# EAGLE design ESPHome 4ch CCT LED driver (EAGLE 9.2.2)
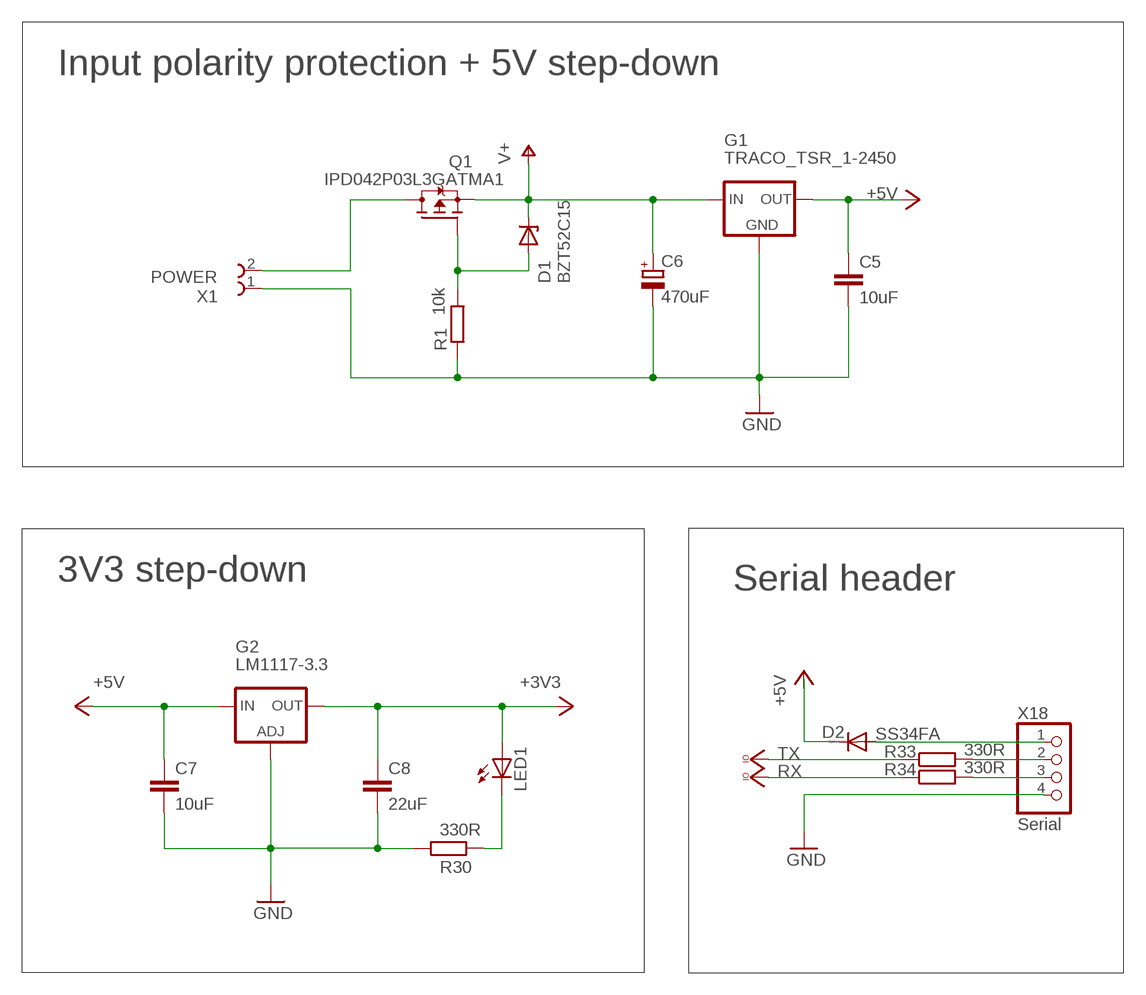
[diagram p0: schematic, sheet 1, part 1 of 2]
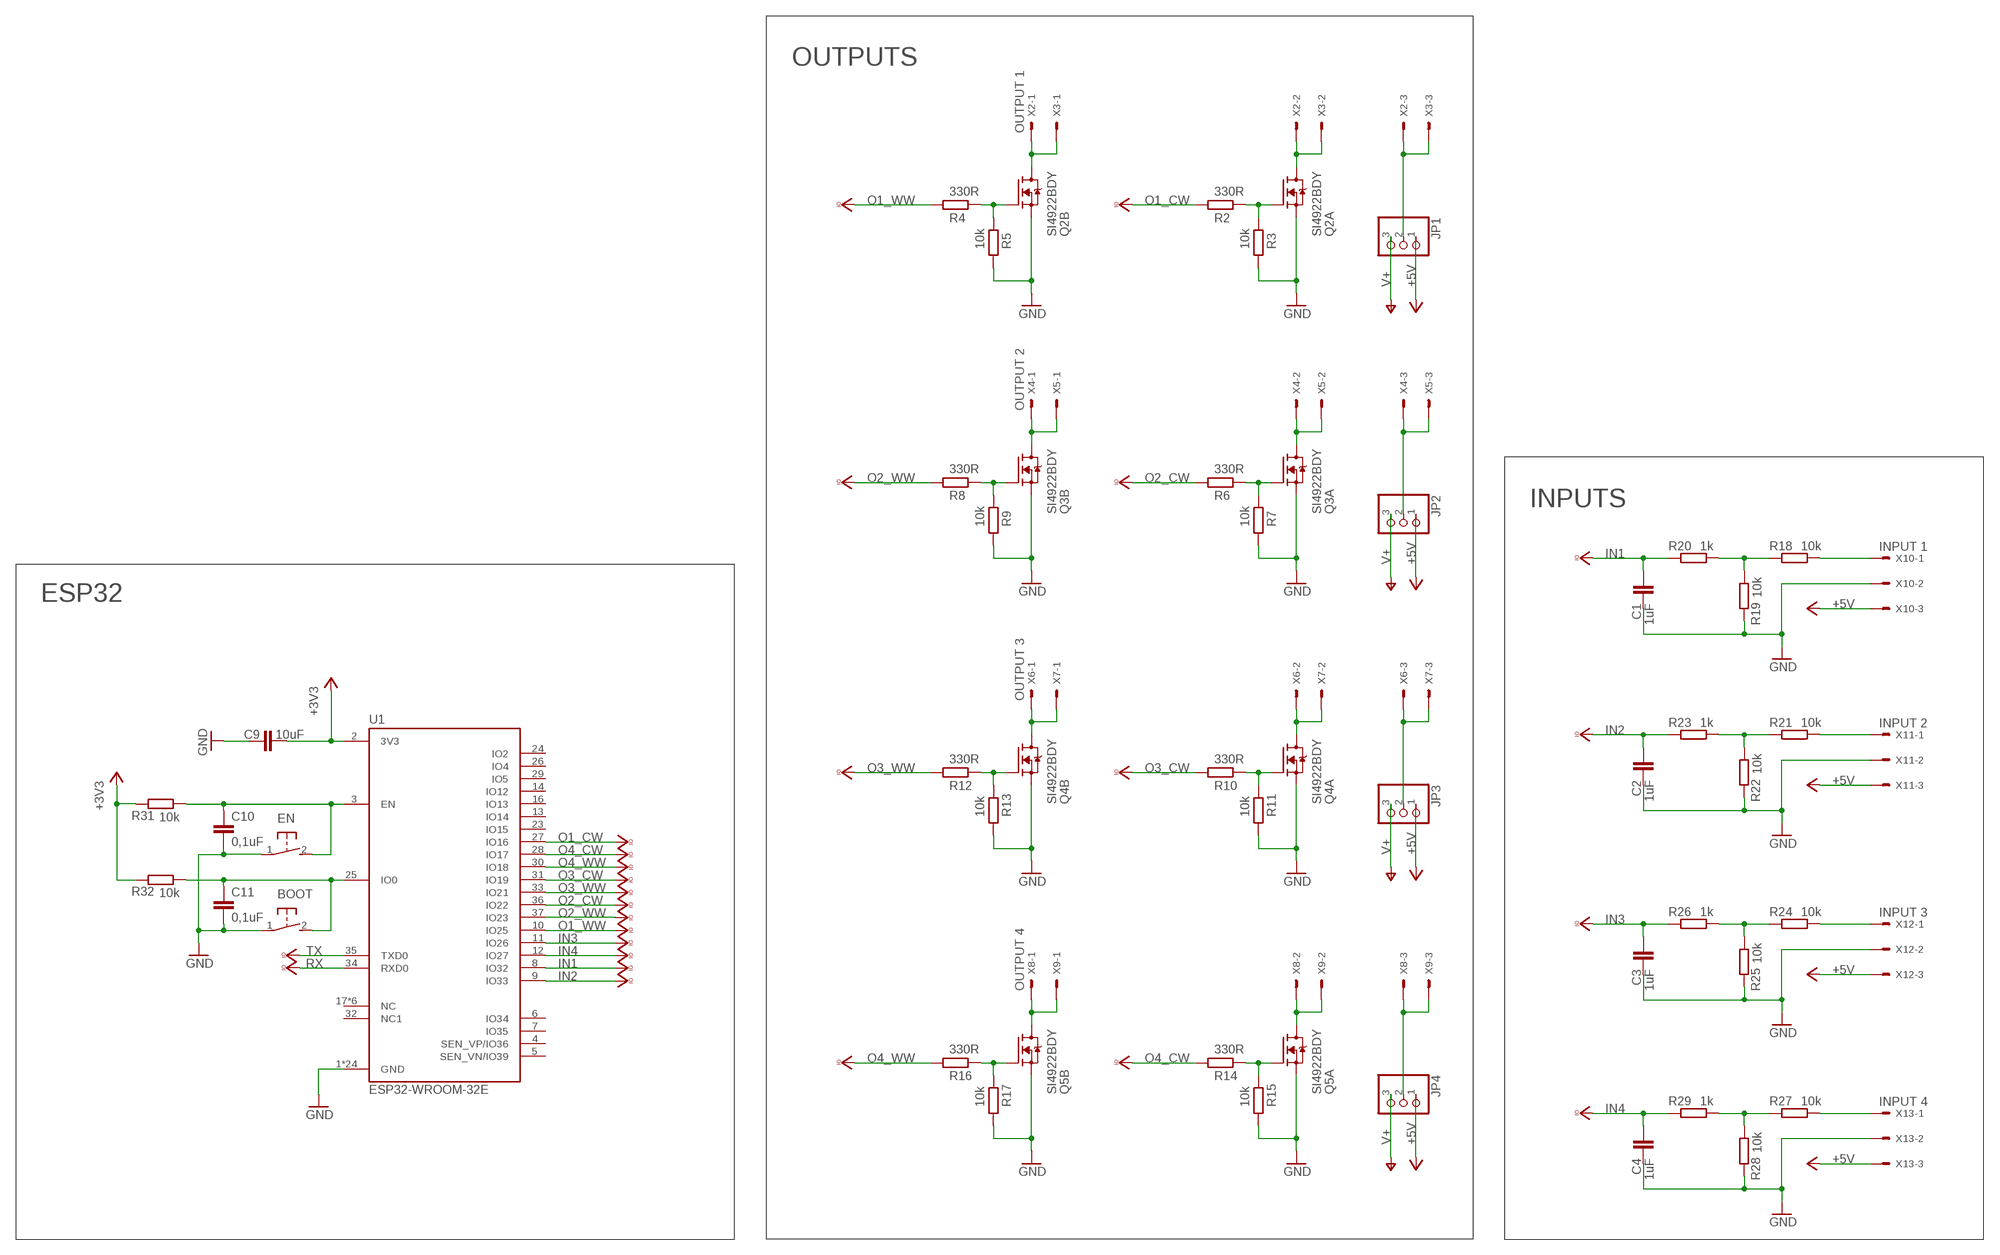
[diagram p1: schematic, sheet 1, part 2 of 2]

## Parts
BOOT  DTSM-3  [DTSM-3]
C1  1uF  C-EUC1206  [C1206]
C2  1uF  C-EUC1206  [C1206]
C3  1uF  C-EUC1206  [C1206]
C4  1uF  C-EUC1206  [C1206]
C5  10uF  C-EUC1206  [C1206]
C6  470uF  CPOL-EUE5-10.5  [E5-10,5]
C7  10uF  C-EUC1206  [C1206]
C8  22uF  C-EUC1206  [C1206]
C9  10uF  C-EUC1206  [C1206]
C10  0,1uF  C-EUC0603  [C0603]
C11  0,1uF  C-EUC0603  [C0603]
D1  BZT52C15  BZT52  [SOD123]
D2  SS34FA  DIODE-SOD123  [SOD123]
EN  DTSM-3  [DTSM-3]
G1  TRACO_TSR_1-2450  [TRACO_TSR_1-24XX]
G2  LM1117-3.3  LM1117  [SOT223]
JP1  PINHD-1X3  [1X03]
JP2  PINHD-1X3  [1X03]
JP3  PINHD-1X3  [1X03]
JP4  PINHD-1X3  [1X03]
LED1  LEDCHIPLED_1206  [CHIPLED_1206]
Q1  IPD042P03L3GATMA1  [TO252]
Q2  SI4922BDY  [SO-8]
Q3  SI4922BDY  [SO-8]
Q4  SI4922BDY  [SO-8]
Q5  SI4922BDY  [SO-8]
R1  10k  R-EU_R0805  [R0805]
R2  330R  R-EU_R0805  [R0805]
R3  10k  R-EU_R0805  [R0805]
R4  330R  R-EU_R0805  [R0805]
R5  10k  R-EU_R0805  [R0805]
R6  330R  R-EU_R0805  [R0805]
R7  10k  R-EU_R0805  [R0805]
R8  330R  R-EU_R0805  [R0805]
R9  10k  R-EU_R0805  [R0805]
R10  330R  R-EU_R0805  [R0805]
R11  10k  R-EU_R0805  [R0805]
R12  330R  R-EU_R0805  [R0805]
R13  10k  R-EU_R0805  [R0805]
R14  330R  R-EU_R0805  [R0805]
R15  10k  R-EU_R0805  [R0805]
R16  330R  R-EU_R0805  [R0805]
R17  10k  R-EU_R0805  [R0805]
R18  10k  R-EU_R0805  [R0805]
R19  10k  R-EU_R0805  [R0805]
R20  1k  R-EU_R0805  [R0805]
R21  10k  R-EU_R0805  [R0805]
R22  10k  R-EU_R0805  [R0805]
R23  1k  R-EU_R0805  [R0805]
R24  10k  R-EU_R0805  [R0805]
R25  10k  R-EU_R0805  [R0805]
R26  1k  R-EU_R0805  [R0805]
R27  10k  R-EU_R0805  [R0805]
R28  10k  R-EU_R0805  [R0805]
R29  1k  R-EU_R0805  [R0805]
R30  330R  R-EU_R0805  [R0805]
R31  10k  R-EU_R0805  [R0805]
R32  10k  R-EU_R0805  [R0805]
R33  330R  R-EU_R0805  [R0805]
R34  330R  R-EU_R0805  [R0805]
U1  ESP32-WROOM-32E  ESP32-WROOM-32E_(16MB)  [XCVR_ESP32-WROOM-32E_(16MB)]
X1  POWER  2PIN_5MM_TERMINAL  [2PIN_5MM_TERMMINAL]
X2  OUTPUT 1  JST-XH-03-PIN-LONG-PAD  [JST-XH-03-PACKAGE-LONG-PAD]
X3  JST-XH-03  JST-XH-03-PIN-LONG-PAD  [JST-XH-03-PACKAGE-LONG-PAD]
X4  OUTPUT 2  JST-XH-03-PIN-LONG-PAD  [JST-XH-03-PACKAGE-LONG-PAD]
X5  JST-XH-03  JST-XH-03-PIN-LONG-PAD  [JST-XH-03-PACKAGE-LONG-PAD]
X6  OUTPUT 3  JST-XH-03-PIN-LONG-PAD  [JST-XH-03-PACKAGE-LONG-PAD]
X7  JST-XH-03  JST-XH-03-PIN-LONG-PAD  [JST-XH-03-PACKAGE-LONG-PAD]
X8  OUTPUT 4  JST-XH-03-PIN-LONG-PAD  [JST-XH-03-PACKAGE-LONG-PAD]
X9  JST-XH-03  JST-XH-03-PIN-LONG-PAD  [JST-XH-03-PACKAGE-LONG-PAD]
X10  INPUT 1  JST-XH-03-PIN-LONG-PAD  [JST-XH-03-PACKAGE-LONG-PAD]
X11  INPUT 2  JST-XH-03-PIN-LONG-PAD  [JST-XH-03-PACKAGE-LONG-PAD]
X12  INPUT 3  JST-XH-03-PIN-LONG-PAD  [JST-XH-03-PACKAGE-LONG-PAD]
X13  INPUT 4  JST-XH-03-PIN-LONG-PAD  [JST-XH-03-PACKAGE-LONG-PAD]
X18  Serial  PINHD-1X4  [1X04]

## Nets
+3V3: C8.1 C9.1 G2.2(OUT) G2.4(OUT) LED1.A R31.1 R32.1 U1.2(3V3)
+5V: C5.1 C7.1 D2.C G1.VOUT(OUT) G2.3(IN) JP1.1 JP2.1 JP3.1 JP4.1 X10.3 X11.3 X12.3 X13.3
GND: BOOT.1 C1.2 C2.2 C3.2 C4.2 C5.2 C6.- C7.2 C8.2 C9.2 C10.2 C11.2 EN.1 G1.GND G2.1(ADJ) Q2.1(A:S) Q2.3(B:S) Q3.1(A:S) Q3.3(B:S) Q4.1(A:S) Q4.3(B:S) Q5.1(A:S) Q5.3(B:S) R1.1 R3.2 R5.2 R7.2 R9.2 R11.2 R13.2 R15.2 R17.2 R19.1 R22.1 R25.1 R28.1 R30.1 U1.1(GND) U1.15(GND) U1.38(GND) U1.39_1(GND) U1.39_2(GND) U1.39_3(GND) U1.39_4(GND) U1.39_5(GND) U1.39_6(GND) U1.39_7(GND) U1.39_8(GND) U1.39_9(GND) U1.39_10(GND) U1.39_11(GND) U1.39_12(GND) U1.39_13(GND) U1.39_14(GND) U1.39_15(GND) U1.39_16(GND) U1.39_17(GND) U1.39_18(GND) U1.39_19(GND) U1.39_20(GND) U1.39_21(GND) X1.1 X10.2 X11.2 X12.2 X13.2 X18.4
IN1: C1.1 R20.1 U1.8(IO32) ; supply symbol labelled VCCIO
IN2: C2.1 R23.1 U1.9(IO33) ; supply symbol labelled VCCIO
IN3: C3.1 R26.1 U1.11(IO26) ; supply symbol labelled VCCIO
IN4: C4.1 R29.1 U1.12(IO27) ; supply symbol labelled VCCIO
N$1: R18.1 R19.2 R20.2
N$2: Q2.4(B:G) R4.2 R5.1
N$3: R21.2 X11.1
N$4: R21.1 R22.2 R23.2
N$5: Q2.2(A:G) R2.1 R3.1
N$6: Q2.7(A:D) Q2.8(A:D) X2.2 X3.2
N$7: D1.A Q1.1(G) R1.2
N$8: BOOT.2 C11.1 R32.2 U1.25(IO0)
N$9: Q3.5(B:D) Q3.6(B:D) X4.1 X5.1
N$10: Q2.5(B:D) Q2.6(B:D) X2.1 X3.1
N$11: Q3.4(B:G) R8.2 R9.1
N$12: Q3.2(A:G) R6.1 R7.1
N$13: JP4.2 X8.3 X9.3
N$14: Q3.7(A:D) Q3.8(A:D) X4.2 X5.2
N$15: JP3.2 X6.3 X7.3
N$16: Q4.4(B:G) R12.2 R13.1
N$17: Q4.2(A:G) R10.1 R11.1
N$18: JP2.2 X4.3 X5.3
N$19: Q4.7(A:D) Q4.8(A:D) X6.2 X7.2
N$20: Q4.5(B:D) Q4.6(B:D) X6.1 X7.1
N$21: Q5.4(B:G) R16.2 R17.1
N$22: Q5.2(A:G) R14.1 R15.1
N$23: JP1.2 X2.3 X3.3
N$24: Q5.7(A:D) Q5.8(A:D) X8.2 X9.2
N$25: Q5.5(B:D) Q5.6(B:D) X8.1 X9.1
N$26: R24.2 X12.1
N$27: R24.1 R25.2 R26.2
N$28: R18.2 X10.1
N$29: R27.2 X13.1
N$30: R27.1 R28.2 R29.2
N$31: Q1.3(D) X1.2
N$32: LED1.C R30.2
N$33: C10.1 EN.2 R31.2 U1.3(EN)
N$34: D2.A X18.1
N$35: R33.2 X18.2
N$36: R34.2 X18.3
O1_CW: R2.2 U1.27(IO16) ; supply symbol labelled VCCIO
O1_WW: R4.1 U1.10(IO25) ; supply symbol labelled VCCIO
O2_CW: R6.2 U1.36(IO22) ; supply symbol labelled VCCIO
O2_WW: R8.1 U1.37(IO23) ; supply symbol labelled VCCIO
O3_CW: R10.2 U1.31(IO19) ; supply symbol labelled VCCIO
O3_WW: R12.1 U1.33(IO21) ; supply symbol labelled VCCIO
O4_CW: R14.2 U1.28(IO17) ; supply symbol labelled VCCIO
O4_WW: R16.1 U1.30(IO18) ; supply symbol labelled VCCIO
RX: R34.1 U1.34(RXD0) ; supply symbol labelled VCCIO
TX: R33.1 U1.35(TXD0) ; supply symbol labelled VCCIO
V+: C6.+ D1.C G1.VIN(IN) JP1.3 JP2.3 JP3.3 JP4.3 Q1.2(S)
Unconnected: U1.4(SEN_VP/IO36) U1.5(SEN_VN/IO39) U1.6(IO34) U1.7(IO35) U1.13(IO14) U1.14(IO12) U1.16(IO13) U1.17(NC) U1.18(NC) U1.19(NC) U1.20(NC) U1.21(NC) U1.22(NC) U1.23(IO15) U1.24(IO2) U1.26(IO4) U1.29(IO5) U1.32(NC1)

## Notes on the sheet
- OUTPUTS
- INPUTS
- Input polarity protection + 5V step-down | ESP32
- 3V3 step-down | Serial header

## Library data of the parts
BOOT EN = switch-tact:DTSM-3
C1-C5 C7-C11 = resistor:C-EU: CAPACITOR, European symbol
C6 = resistor:CPOL-EU: POLARIZED CAPACITOR, European symbol
D1 = diode:BZT52
D2 = diode:DIODE-: DIODE
G1 = Voltage:TRACO_TSR_1-2450
G2 = Voltage:LM1117
JP1-JP4 = Headery:PINHD-1X3: PIN HEADER
LED1 = led:LED: LED OSRAM: - CHIPLED LG R971, LG N971, LY N971, LG Q971, LY Q971, LO R971, LY R971 LH N974, LH R974 LS Q976, LO Q976, LY Q976 LO Q996 - Hyper CHIPLED LW Q18S LB Q993, LB Q99A, LB R99A - SideLED LS A670, LO A670, LY A670, LG A670, LP A670 LB A673, LV A673, LT A673, LW A673 LH A674 LY A675 LS A676, LA A676, LO A676, LY A676, LW A676 LS A679, LY A679, LG A679 - Hyper Micro SIDELED® LS Y876, LA Y876, LO Y876, LY Y876 LT Y87S - SmartLED LW L88C, LW L88S LB L89C, LB L89S, LG L890 LS L89K, LO L89K, LY L89K LS L896, LA L896, LO L896, LY L896 - TOPLED LS T670, LO T670, LY T670, LG T670, LP T670 LSG T670, LSP T670, LSY T670, LOP T670, LYG T670 LG T671, LOG T671, LSG T671 LB T673, LV T673, LT T673, LW T673 LH T674 LS T676, LA T676, LO T676, LY T676, LB T676, LH T676, LSB T676, LW T676 LB T67C, LV T67C, LT T67C, LS T67K, LO T67K, LY T67K, LW E67C LS E67B, LA E67B, LO E67B, LY E67B, LB E67C, LV E67C, LT E67C LW T67C LS T679, LY T679, LG T679 LS T770, LO T770, LY T770, LG T770, LP T770 LB T773, LV T773, LT T773, LW T773 LH T774 LS E675, LA E675, LY E675, LS T675 LS T776, LA T776, LO T776, LY T776, LB T776 LHGB T686 LT T68C, LB T68C - Hyper Mini TOPLED® LB M676 - Mini TOPLED Santana® LG M470 LS M47K, LO M47K, LY M47K Source: http://www.osram.convergy.de LUXEON: - LUMILED® LXK2-PW12-R00, LXK2-PW12-S00, LXK2-PW14-U00, LXK2-PW14-V00 LXK2-PM12-R00, LXK2-PM12-S00, LXK2-PM14-U00 LXK2-PE12-Q00, LXK2-PE12-R00, LXK2-PE12-S00, LXK2-PE14-T00, LXK2-PE14-U00 LXK2-PB12-K00, LXK2-PB12-L00, LXK2-PB12-M00, LXK2-PB14-N00, LXK2-PB14-P00, LXK2-PB14-Q00 LXK2-PR12-L00, LXK2-PR12-M00, LXK2-PR14-Q00, LXK2-PR14-R00 LXK2-PD12-Q00, LXK2-PD12-R00, LXK2-PD12-S00 LXK2-PH12-R00, LXK2-PH12-S00 LXK2-PL12-P00, LXK2-PL12-Q00, LXK2-PL12-R00 Source: www.luxeon.com KINGBRIGHT: KA-3528ASYC Source: www.kingbright.com
Q1 = transistor-fet:IPD042P03L3GATMA1
Q2-Q5 = transistor-fet:SI4922BDY
R1-R34 = resistor:R-EU_: RESISTOR, European symbol
U1 = ESP_CHIP:ESP32-WROOM-32E_(16MB): Check availability <https://pricing.snapeda.com/parts/ESP32-WROOM-32E%20%2816MB%29/Espressif%20Systems/view-part?ref=eda>; AVAILABILITY: Not in stock; DESCRIPTION: Bluetooth, WiFi 802.11b/g/n, Bluetooth v4.2 +EDR, Class 1, 2 and 3 Transceiver Module 2.4GHz ~ 2.5GHz Integrated, Trace Surface Mount; MF: Espressif Systems; MP: ESP32-WROOM-32E (16MB); PACKAGE: SMD-44 Espressif Systems; PRICE: None
X1 = Terminaly:2PIN_5MM_TERMINAL
X2-X13 = JST XH Connectors v1-0:JST-XH-03-PIN: JST XH Connector 2 Pin Wire to board connector. Pitch: 2,54 mm, (0.100") Number of pins: 3 Created by Rembrandt Electronics www.rembrandtelectronics.com
X18 = Headery:PINHD-1X4

## Board
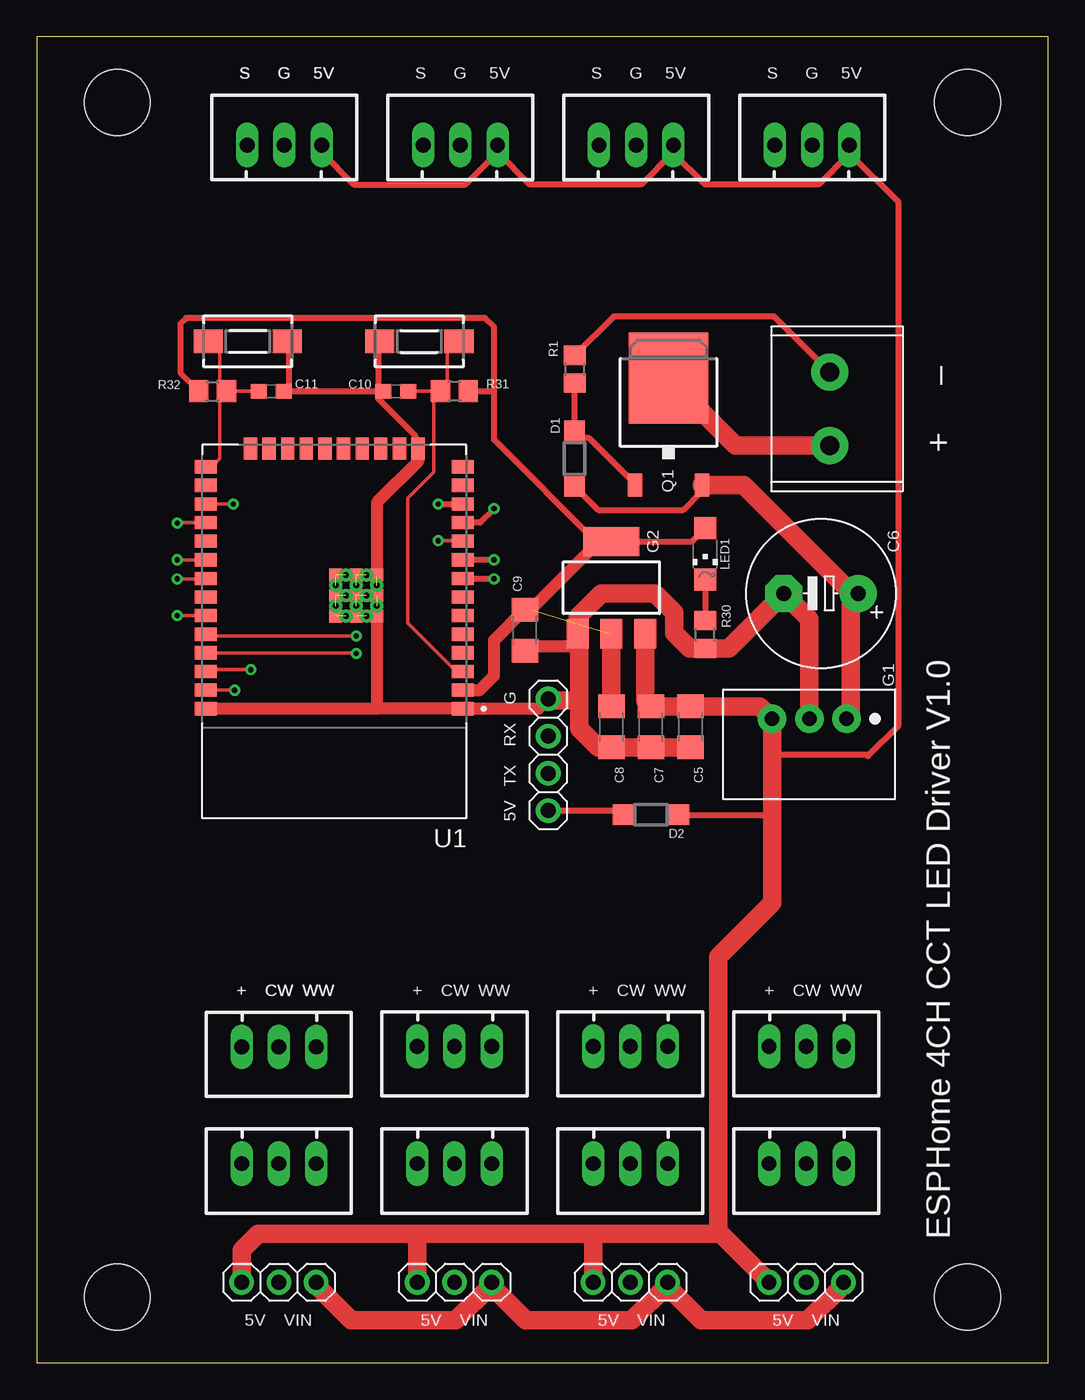
[diagram p2: board, top side]
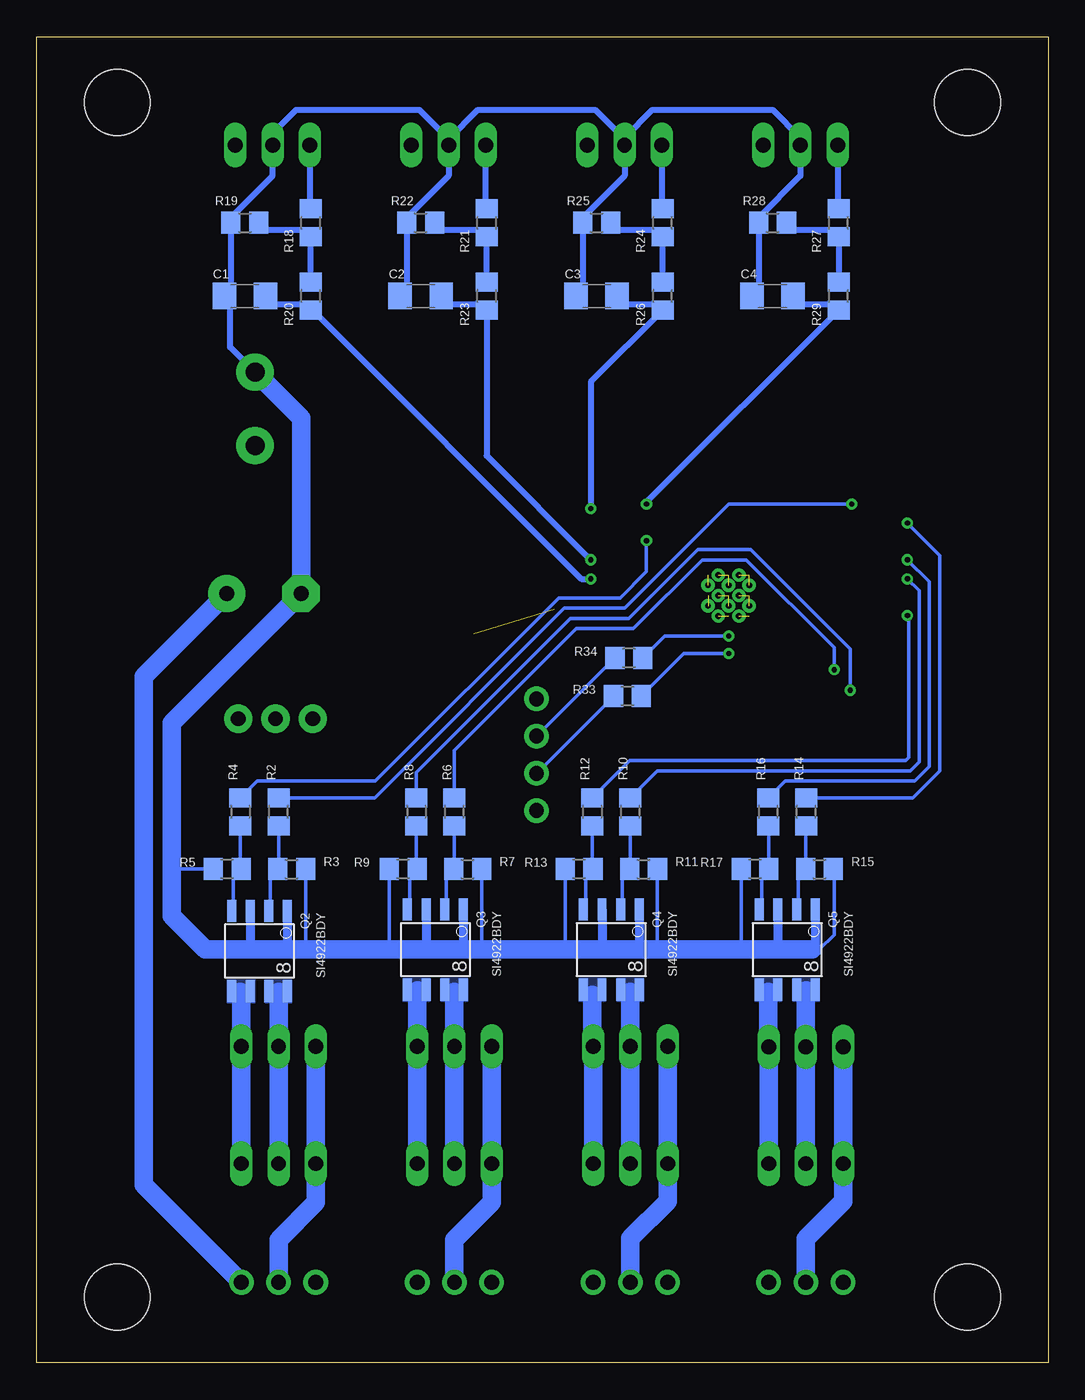
[diagram p3: board, bottom side, seen from below]

Size 69 x 90.5 mm. Coordinates in mm from the lower left corner, seen from the top.
Outline: 0,0 69,0 69,90.5 0,90.5 0,0
Copper layers (1*16): Top 0.035mm / dielectric 1.5mm / Bottom 0.035mm
Design rules "default": minimum track width 6mil, minimum drill 0.35mm, track to track 6mil, track to pad 6mil, pad to pad 6mil, via to via 6mil, smd to smd 6mil, copper to edge 40mil, drill to drill 6mil, minimum pad ring 10mil, minimum via ring 8mil, stop-mask expansion 4mil, vias tented up to drill 0mil, thermal gap 10mil
Holes 4.5 mm at 5.5,86 63.5,86 63.5,4.5 5.5,4.5

### Footprints (pad centres in the part's own frame; a part is rotated, then mirrored left to right if it is on the bottom)
DTSM-3 = smd 2 x 1.6: 1 -2.7,0; 2 2.7,0
C1206 = smd 1.6 x 1.8: 1 -1.4,0; 2 1.4,0
E5-10,5 = drill 1.016 pad 2.54: + -2.54,0 | drill 1.016 pad 2.54 octagon: - 2.54,0
C0603 = smd 1.1 x 1: 1 -0.85,0; 2 0.85,0
SOD123 = smd 1.4 x 1.4: A 1.9,0; C -1.9,0
TRACO_TSR_1-24XX = drill 1 pad 1.93: GND -0.01,-1.75; VIN -2.55,-1.75; VOUT 2.53,-1.75
SOT223 = smd 1.5 x 2: 1 -2.3,-3.15; 2 0,-3.15; 3 2.3,-3.15 | smd 3.8 x 2: 4 0,3.15
1X03 = drill 1.016 pad 1.676: 1 -2.54,0; 2 0,0; 3 2.54,0
CHIPLED_1206 = smd 1.5 x 1.5: A 0,-1.75; C 0,1.75
TO252 = smd 1 x 1.6: 1 -2.28,-4.8; 2 2.28,-4.8 | smd 5.4 x 6.2: 3 0,2.5
SO-8 = smd 1.524 x 0.61: 1 -2.743,1.905; 2 -2.743,0.635; 3 -2.743,-0.635; 4 -2.743,-1.905; 5 2.743,-1.905; 6 2.743,-0.635; 7 2.743,0.635; 8 2.743,1.905
R0805 = smd 1.3 x 1.5: 1 -0.95,0; 2 0.95,0
XCVR_ESP32-WROOM-32E_(16MB) = smd 1.5 x 0.9: 1 -8.75,5.26; 2 -8.75,3.99; 3 -8.75,2.72; 4 -8.75,1.45; 5 -8.75,0.18; 6 -8.75,-1.09; 7 -8.75,-2.36; 8 -8.75,-3.63; 9 -8.75,-4.9; 10 -8.75,-6.17; 11 -8.75,-7.44; 12 -8.75,-8.71; 13 -8.75,-9.98; 14 -8.75,-11.25; 25 8.75,-11.25; 26 8.75,-9.98; 27 8.75,-8.71; 28 8.75,-7.44; 29 8.75,-6.17; 30 8.75,-4.9; 31 8.75,-3.63; 32 8.75,-2.36; 33 8.75,-1.09; 34 8.75,0.18; 35 8.75,1.45; 36 8.75,2.72; 37 8.75,3.99; 38 8.75,5.26 | smd 0.9 x 1.5: 15 -5.715,-12.5; 16 -4.445,-12.5; 17 -3.175,-12.5; 18 -1.905,-12.5; 19 -0.635,-12.5; 20 0.635,-12.5; 21 1.905,-12.5; 22 3.175,-12.5; 23 4.445,-12.5; 24 5.715,-12.5 | smd 0.9 x 0.9: 39_1 -2.9,-1.06; 39_2 -1.5,-1.06; 39_3 -0.1,-1.06; 39_4 -2.9,-2.46; 39_5 -1.5,-2.46; 39_6 -0.1,-2.46; 39_7 -2.9,-3.86; 39_8 -1.5,-3.86; 39_9 -0.1,-3.86 | drill 0.4: 39_10 -2.2,-1.06; 39_11 -0.8,-1.06; 39_12 -2.9,-1.76; 39_13 -1.5,-1.76; 39_14 -0.1,-1.76; 39_15 -2.2,-2.46; 39_16 -0.8,-2.46; 39_17 -2.9,-3.16; 39_18 -1.5,-3.16; 39_19 -0.1,-3.16; 39_20 -2.2,-3.86; 39_21 -0.8,-3.86
2PIN_5MM_TERMMINAL = drill 1.3 pad 2.54: 1 -2.5,0; 2 2.5,0
JST-XH-03-PACKAGE-LONG-PAD = drill 1.016 long: 1 -2.54,0; 2 0,0; 3 2.54,0
1X04 = drill 1.016 pad 1.676: 1 -3.81,0; 2 -1.27,0; 3 1.27,0; 4 3.81,0

### Placement (x,y rotation side)
BOOT  14.4,69.7 180 top
C1  54.8,72.8 180 bottom
C2  42.8,72.8 180 bottom
C3  30.8,72.8 180 bottom
C4  18.8,72.8 180 bottom
C5  44.6,43.4 270 top
C6  53.5,52.5 180 top
C7  41.9,43.4 270 top
C8  39.2,43.4 270 top
C9  33.3,50 270 top
C10  24.5,66.3 180 top
C11  16,66.3 0 top
D1  36.7,61.7 90 top
D2  41.9,37.4 180 top
EN  26.1,69.7 0 top
G1  52.7,42.2 180 top
G2  39.2,52.9 0 top
JP1  52.5,5.5 0 top
JP2  40.5,5.5 0 top
JP3  28.5,5.5 0 top
JP4  16.52,5.5 0 top
LED1  45.6,55.2 180 top
Q1  43.1,64.7 0 top
Q2  53.8,28.1 270 bottom
Q3  41.8,28.2 270 bottom
Q4  29.8,28.2 270 bottom
Q5  17.8,28.2 270 bottom
R1  36.7,67.8 270 top
R2  52.5,37.6 90 bottom
R3  51.6,33.7 0 bottom
R4  55.1,37.6 270 bottom
R5  56,33.7 180 bottom
R6  40.5,37.6 90 bottom
R7  39.6,33.7 0 bottom
R8  43.1,37.6 270 bottom
R9  44,33.7 180 bottom
R10  28.5,37.6 90 bottom
R11  27.6,33.7 0 bottom
R12  31.1,37.6 270 bottom
R13  32,33.7 180 bottom
R14  16.5,37.6 90 bottom
R15  15.6,33.7 0 bottom
R16  19.1,37.6 270 bottom
R17  20,33.7 180 bottom
R18  50.3,77.8 90 bottom
R19  54.8,77.8 0 bottom
R20  50.3,72.8 90 bottom
R21  38.3,77.8 90 bottom
R22  42.8,77.8 0 bottom
R23  38.3,72.8 90 bottom
R24  26.3,77.8 90 bottom
R25  30.8,77.8 0 bottom
R26  26.3,72.8 90 bottom
R27  14.3,77.8 90 bottom
R28  18.8,77.8 0 bottom
R29  14.3,72.8 90 bottom
R30  45.6,49.7 90 top
R31  28.5,66.3 180 top
R32  12,66.3 0 top
R33  28.7,45.5 180 bottom
R34  28.6,48.1 180 bottom
U1  20.3,49.9 180 top
X1  54.1,65.1 270 top
X2  52.5,13.6 180 top
X3  52.5,21.6 180 top
X4  40.5,13.6 180 top
X5  40.5,21.6 180 top
X6  28.5,13.6 180 top
X7  28.5,21.6 180 top
X8  16.52,13.6 180 top
X9  16.52,21.56 180 top
X10  52.9,83.1 0 top
X11  40.9,83.1 0 top
X12  28.9,83.1 0 top
X13  16.9,83.1 0 top
X18  34.9,41.5 90 top

### Tracks (layer width: path | path; a pad name or v marks a point on that pad's centre or on a via)
+3V3  (1 unrouted)
  Top 0.406: 39.5,56.05 G2.4 38.15,56.05 31.2,63 31.2,66.3 | 39.7,56.05 44.7,56.05 LED1.A | R32.1 9.8,67.55 9.8,70.9 10.2,71.3 30.6,71.3 31.2,70.7 31.2,66.3 | R31.1 31.2,66.3
  Top 0.61: 38.15,56.05 39.5,56.05 39.7,56.05
  Top 0.813: U1.2 30.21,45.91 31.2,46.9 31.2,49.3 C9.1 33.7,51.4 38.35,56.05 39.5,56.05
  Top 1.27: C8.1 G2.2
+5V
  Top 0.406: 50.17,43.77 G1.VOUT | D2.C 50.07,37.4 50.17,37.5 | 50.17,41.5 56.6,41.5 56.7,41.4 58.8,43.5 58.8,79.2 55.44,82.56 X10.3 55.44,82.5 53.34,80.4 45.6,80.4 43.44,82.56 X11.3 43.44,82.6 41.24,80.4 33.64,80.4 31.44,82.6 | X13.3 19.44,82.6 21.64,80.4 29.24,80.4 31.44,82.6 | 31.44,82.6 X12.3
  Top 1.27: G2.3 41.5,45.2 C7.1 C5.1 49.32,44.8 G1.VOUT 50.17,41.5 50.17,37.5 50.17,31.37 46.5,27.7 46.5,8.96 46.66,8.8 | 46.66,8.8 JP1.1 | JP4.1 13.98,7.68 15.1,8.8 25.9,8.8 | 25.9,8.8 37.8,8.8 | 37.8,8.8 46.66,8.8 | JP3.1 25.96,8.74 25.9,8.8 | JP2.1 37.96,8.64 37.8,8.8
GND  (12 unrouted)
  Top 0.406: EN.1 23.3,69.6 23.3,66.65 C10.2 | 23.3,66.3 C11.2 17.2,66.65 17.2,69.6 BOOT.1 | 23.3,66.3 23.4,66.3 | U1.15 25.82,62.6 25.82,63.28 23.3,65.8 23.3,66.3 | X1.1 50.3,71.4 39.35,71.4 R1.1
  Top 0.61: U1.39_2 U1.39_5 | U1.39_5 U1.39_4 | U1.39_2 U1.39_1 U1.39_4 | U1.39_2 U1.39_3 U1.39_6 | U1.39_6 U1.39_9 U1.39_8 | U1.39_8 U1.39_7 U1.39_4 | U1.39_8 U1.39_5 | U1.39_6 U1.39_5 | 23.4,66.3 C10.2
  Top 0.813: X18.4 34.23,44.64 U1.1 23.2,44.64 | U1.15 26.02,61.52 23.2,58.7 U1.39_7 | U1.38 23.2,44.64 | U1.39_1 23.2,44.64 | C9.2 33.6,48.9 37,48.9
  Top 1.27: 37,45.2 37,48.9 37,49.65 G2.1 36.9,50.9 38.5,52.5 42.2,52.5 43.5,51.2 43.5,49.8 44.55,48.75 R30.1 47.21,48.75 C6.- 52.71,50.75 G1.GND | 37,45.2 37,43.3 38.3,42 C8.2 C7.2 C5.2 | X18.4 35.01,45.2 37,45.2
  Bottom 0.254: R11.2 26.65,28.25 26.6,28.2 | R15.2 14.6,33.65 14.6,29.2 15.6,28.2 16.1,28.2 | R17.2 20.95,28.25 20.9,28.2 | R13.2 32.95,28.25 33,28.2 | R7.2 38.65,28.35 38.5,28.2 | R9.2 44.95,28.25 45,28.2 | R3.2 50.65,28.25 50.7,28.2 | R5.2 59.8,33.7
  Bottom 0.406: X1.1 55.8,69.3 55.8,72.4 C1.2 55.75,73.25 R19.1 55.75,78.15 52.9,81 X10.2 52.9,83.9 51.3,85.5 42.9,85.5 40.9,83.5 | C2.2 43.75,73.25 R22.1 43.75,78.15 40.9,81 X11.2 40.9,83.5 | C3.2 31.75,73.25 R25.1 31.75,78.15 28.9,81 X12.2 | C4.2 19.75,73.25 R28.1 19.75,78.15 16.9,81 X13.2 16.9,83.6 18.8,85.5 27,85.5 28.9,83.6 X12.2 | 40.9,83.5 38.9,85.5 30.9,85.5 28.9,83.5 X12.2
  Bottom 0.61: Q3.1 39.9,28.2 | Q3.3 42.44,28.23 42.4,28.2 | Q2.1 51.9,28.2 | Q2.3 54.44,28.23 54.4,28.2 | Q4.1 27.89,28.2 27.9,28.2 | Q4.3 30.43,28.23 30.4,28.2 | Q5.3 18.43,28.23 18.4,28.2 | Q5.1 15.89,28.41 16.1,28.2
  Bottom 1.27: X1.1 50.96,64.46 C6.- 59.8,43.66 59.8,33.7 59.8,30.5 57.5,28.2 54.4,28.2 51.9,28.2 50.7,28.2 45,28.2 42.4,28.2 39.9,28.2 38.5,28.2 33,28.2 30.4,28.2 27.9,28.2 26.6,28.2 20.9,28.2 18.4,28.2 16.1,28.2
IN1  (via drill 0.35)
  Top 0.406: v31.2,53.5 29.08,53.5 U1.8
  Bottom 0.406: C1.1 53.4,72.4 53.2,72.2 50.65,72.2 R20.1 50.25,71.9 31.85,53.5 v31.2,53.5
IN2  (via drill 0.35)
  Top 0.406: v31.2,54.8 U1.9
  Bottom 0.406: C2.1 41,72.4 41,72.2 38.65,72.2 R23.1 38.3,61.9 v31.2,54.8
IN3  (via drill 0.35)
  Top 0.406: v31.2,58.3 30.24,57.34 U1.11
  Bottom 0.406: C3.1 29,72.4 29,72.2 26.65,72.2 R26.1 31.2,66.95 v31.2,58.3
IN4  (via drill 0.35)
  Top 0.406: v27.4,58.6 U1.12
  Bottom 0.406: R29.1 13.95,72.2 | R29.1 14.65,72.2 16.8,72.2 C4.1 | R29.1 27.4,58.75 v27.4,58.6
N$1
  Bottom 0.406: R20.2 R18.1 50.75,77.3 53.5,77.3 53.85,77.65 R19.2
N$2
  Bottom 0.254: R4.2 55.1,33.75 R5.1 55.6,33.15 55.6,30.94 Q2.4
N$3
  Bottom 0.406: R21.2 38.36,78.81 X11.1
N$4
  Bottom 0.406: R23.2 R21.1 38.75,77.3 41.5,77.3 41.85,77.65 R22.2
N$5
  Bottom 0.254: R2.1 52.5,33.75 R3.1 53.06,33.19 53.06,30.94 Q2.2
N$6
  Bottom 0.254: Q2.8 Q2.7
  Bottom 1.27: 52.5,25.3 X3.2 X2.2
  pour Bottom (no thermals): 51.6,26.1 53.4,26.1 53.4,24.6 51.6,24.6
N$7
  Top 0.406: R1.2 D1.A 36.7,63.4 37,63.1 37.7,63.1 40.82,59.98 Q1.1
N$8
  Top 0.254: BOOT.2 11.9,69.7 12.5,69.1 12.5,66.75 R32.2 | R32.2 C11.1 | R32.2 12.5,65.85 12.5,61.7 12.1,61.3 11.7,61.3 U1.25
N$9
  Bottom 0.254: Q3.6 Q3.5
  Bottom 1.27: 43,25.4 43.04,25.36 X5.1 X4.1
  pour Bottom (no thermals): 42.2,26.2 44,26.2 44,24.7 42.2,24.7
N$10
  Bottom 0.254: Q2.6 Q2.5
  Bottom 1.27: 55.1,25.3 55.04,25.24 X3.1 X2.1
  pour Bottom (no thermals): 54.1,26.1 56,26.1 56,24.6 54.1,24.6
N$11
  Bottom 0.254: R8.2 43.1,33.75 R9.1 43.55,33.2 43.55,31 Q3.4
N$12
  Bottom 0.254: R6.1 40.5,33.75 R7.1 41.05,33.2 41.05,30.96 Q3.2
N$13
  Bottom 1.27: X9.3 X8.3 13.98,11.02 16.52,8.48 JP4.2
N$14
  Bottom 0.254: Q3.8 Q3.7
  Bottom 1.27: 40.5,25.3 X5.2 X4.2
  pour Bottom (no thermals): 39.6,26.2 41.4,26.2 41.4,24.7 39.6,24.7
N$15
  Bottom 1.27: X7.3 X6.3 25.96,11.04 28.5,8.5 JP3.2
N$16
  Bottom 0.254: R12.2 31.1,33.75 R13.1 31.55,33.2 31.55,31 Q4.4
N$17
  Bottom 0.254: R10.1 28.5,33.75 R11.1 29.05,33.2 29.05,30.96 Q4.2
N$18
  Bottom 1.27: X5.3 X4.3 37.96,10.94 40.5,8.4 JP2.2
N$19
  Bottom 0.254: Q4.8 Q4.7
  Bottom 1.27: 28.5,25.3 X7.2 X6.2
  pour Bottom (no thermals): 27.6,26.2 29.4,26.2 29.4,24.7 27.6,24.7
N$20
  Bottom 0.254: Q4.6 Q4.5
  Bottom 1.27: 31.1,25.1 31.1,21.66 X7.1 X6.1
  pour Bottom (no thermals): 30.2,26.2 32,26.2 32,24.7 30.2,24.7
N$21
  Bottom 0.254: R16.2 19.05,36.6 R17.1 19.55,33.2 19.55,31.1 Q5.4
N$22
  Bottom 0.254: 16.5,36.5 R14.1 | Q5.2 17.05,31.06 17.05,33.2 R15.1 16.55,36.45
  Bottom 0.406: 16.55,36.45 16.5,36.5
N$23
  Bottom 1.27: X3.3 X2.3 49.96,10.94 52.5,8.4 JP1.2
N$24
  Bottom 0.254: Q5.8 Q5.7
  Bottom 1.27: 16.5,25.4 16.52,25.38 X9.2 X8.2
  pour Bottom (no thermals): 15.6,26.2 17.4,26.2 17.4,24.7 15.6,24.7
N$25
  Bottom 0.254: Q5.6 Q5.5
  Bottom 1.27: 19.1,25.3 19.1,21.6 X9.1 X8.1
  pour Bottom (no thermals): 18.2,26.2 20,26.2 20,24.7 18.2,24.7
N$26
  Bottom 0.406: X12.1 26.36,78.81 R24.2
N$27
  Bottom 0.406: R25.2 29.85,77.65 29.5,77.3 26.8,77.3 26.35,76.85 R24.1 R26.2
N$28
  Bottom 0.406: X10.1 50.36,78.81 R18.2
N$29
  Bottom 0.406: X13.1 14.36,78.81 R27.2
N$30
  Bottom 0.406: R27.1 R29.2 | 14.3,76.9 R27.1 | R27.1 14.75,77.3 17.4,77.3 17.85,77.75 R28.2
N$31
  Top 1.27: X1.2 47.7,62.6 Q1.3
N$32
  Top 0.406: LED1.C R30.2
N$33
  Top 0.254: C10.1 27.1,66.3 | 27.1,66.3 R31.2 27.6,66.3 28,66.7 28,69.1 28.1,69.2 28.3,69.2 EN.2 | U1.3 28.62,47.18 25.3,50.5 25.3,59 27.1,60.8 27.1,66.3
N$34
  Top 0.406: X18.1 39.71,37.69 D2.A
N$35
  Bottom 0.254: X18.2 29.65,45.48 R33.2
N$36
  Bottom 0.254: R34.2 29.57,48.1 X18.3
O1_CW  (via drill 0.35)
  Top 0.254: v13.4,58.6 U1.27
  Bottom 0.254: R2.2 45.95,38.55 33,51.5 28.9,51.5 21.8,58.6 v13.4,58.6
O1_WW  (via drill 0.35)
  Top 0.254: v27.4,56.1 29.02,56.1 U1.10
  Bottom 0.254: R4.1 53.95,39.7 45.9,39.7 33.4,52.2 29.2,52.2 27.4,54 v27.4,56.1
O2_CW  (via drill 0.35)
  Top 0.254: v14.6,47.3 11.67,47.3 U1.36
  Bottom 0.254: R6.2 40.5,41.8 32.2,50.1 28.3,50.1 23.6,54.8 20.6,54.8 14.6,48.8 v14.6,47.3
O2_WW  (via drill 0.35)
  Top 0.254: v13.5,45.9 U1.37
  Bottom 0.254: R8.1 43.1,40.3 32.6,50.8 28.6,50.8 23.9,55.5 20.3,55.5 13.5,48.7 v13.5,45.9
O3_CW  (via drill 0.35)
  Top 0.254: v9.6,53.5 11.52,53.5 U1.31
  Bottom 0.254: R10.2 26.65,40.4 9.4,40.4 8.8,41 8.8,52.7 v9.6,53.5
O3_WW  (via drill 0.35)
  Top 0.254: v9.6,51 v9.61,50.99 U1.33
  Bottom 0.254: R12.1 28.55,41.1 9.7,41.1 9.5,41.3 9.5,50.9 v9.6,51
O4_CW  (via drill 0.35)
  Top 0.254: v9.6,57.3 9.64,57.34 U1.28
  Bottom 0.254: R14.2 9.25,38.55 7.4,40.4 7.4,55.1 v9.6,57.3
O4_WW  (via drill 0.35)
  Top 0.254: U1.30 v9.6,54.8
  Bottom 0.254: R16.1 17.95,39.7 9.1,39.7 8.1,40.7 8.1,53.3 v9.6,54.8
RX  (via drill 0.35)
  Top 0.254: v21.8,49.6 11.67,49.6 U1.34
  Bottom 0.254: R34.1 26.15,49.6 v21.8,49.6
TX  (via drill 0.35)
  Top 0.254: v21.8,48.4 21.8,48.45 U1.35
  Bottom 0.254: v21.8,48.4 24.85,48.4 R33.1
V+
  Top 0.406: D1.C 38.3,58.2 44.1,58.2 45.38,59.48 Q1.2
  Top 1.27: Q1.2 48.24,59.9 55.64,52.5 C6.+ 55.54,52 55.54,44.24 G1.VIN | JP4.3 19.06,5.3 21.46,2.9 28.6,2.9 31.04,5.34 | 31.04,5.34 JP3.3 | 31.04,5.34 31.04,5.24 33.38,2.9 40.6,2.9 43.04,5.34 JP2.3 43.04,5.2 45.34,2.9 52.6,2.9 55.04,5.34 JP1.3
  Bottom 1.27: JP1.3 61.7,12.16 61.7,46.84 C6.+

### Text on the board
tNames: S G 5V | S G 5V | S G 5V | S G 5V | S G 5V | + – | 5V TX RX G | ESPHome 4CH CCT LED Driver V1.0 | + CW WW | + CW WW | + CW WW | + CW WW | + CW WW | 5V VIN | 5V VIN | 5V VIN | 5V VIN